# Altium schematic sheet PowerSrc.SchDoc
size A3
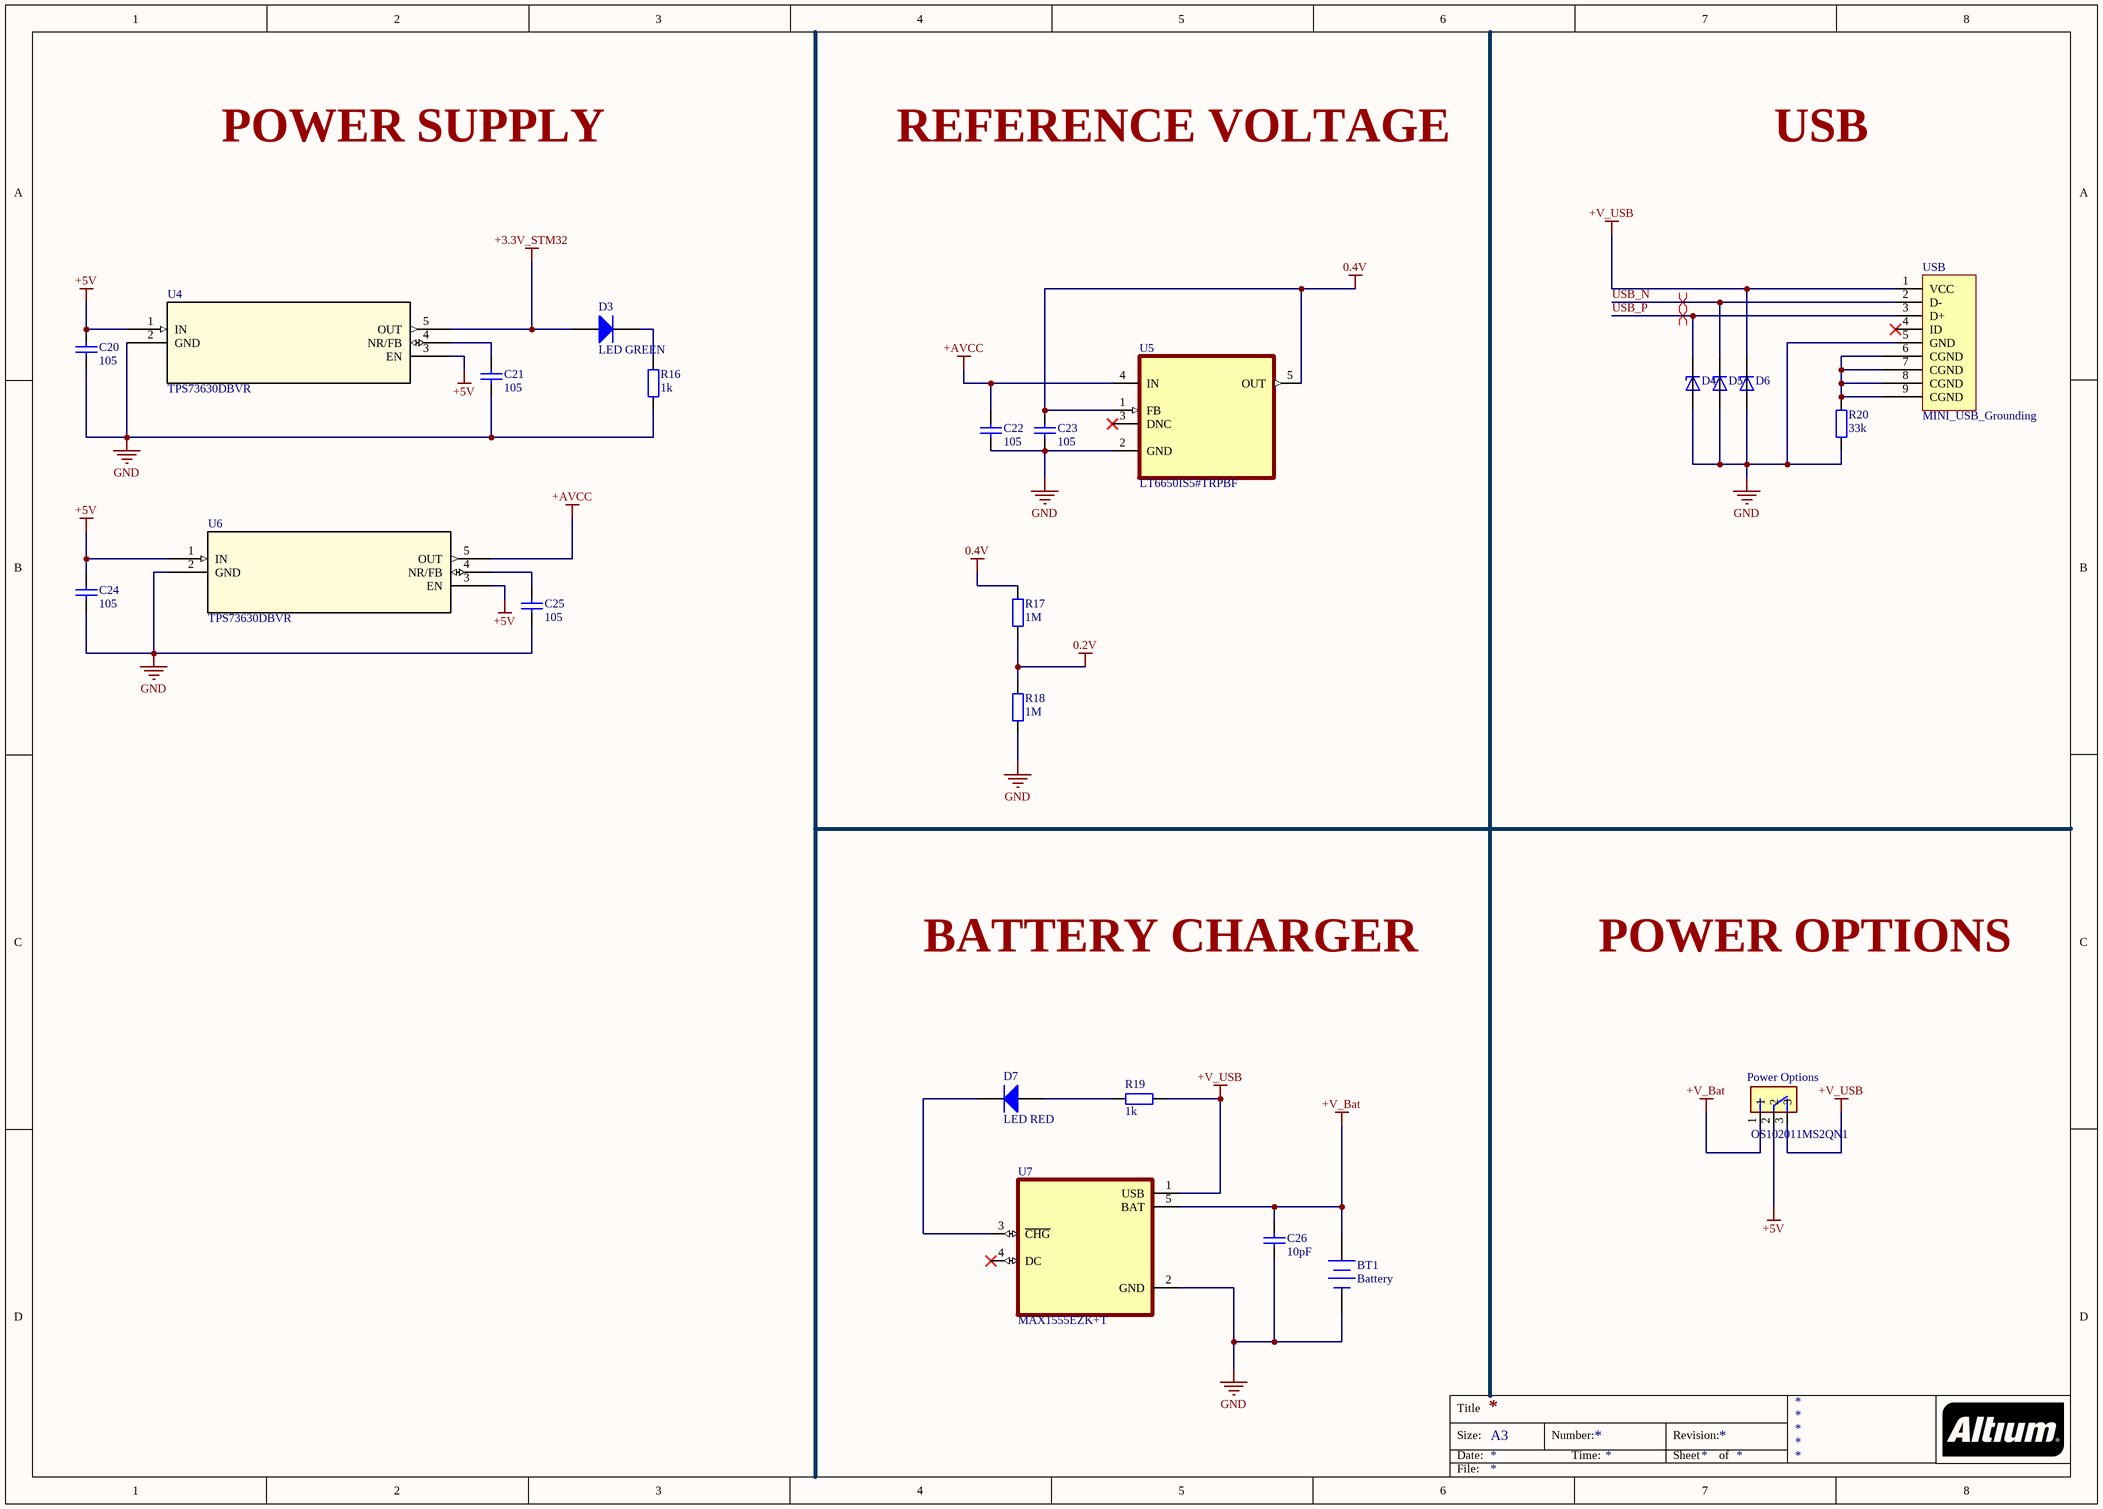
[diagram p0: PowerSrc.SchDoc]

## Parts
BT1  Battery  [BAT-2]
C20  105  [tu 0603]
C21  105  [tu 0603]
C22  105  [tu 0603]
C23  105  [tu 0603]
C24  105  [tu 0603]
C25  105  [tu 0603]
C26  10pF  [tu 0805]
D3  LED GREEN  [J1-0603]
D4  AVRL161A1R1NTA  [TVS_AVRL161A1R1NTA]  (value not drawn)
D5  AVRL161A1R1NTA  [TVS_AVRL161A1R1NTA]  (value not drawn)
D6  AVRL161A1R1NTA  [TVS_AVRL161A1R1NTA]  (value not drawn)
D7  LED RED  [J1-0603]
Power_Options  OS102011MS2QN1  [SW_OS102011MS2QN1]
R16  1k  [tro smd 0603]
R17  1M  [tro smd 0603]
R18  1M  [tro smd 0603]
R19  1k  [tro smd 0603]
R20  33k  [Tro smd 0603]
U4  TPS73630DBVR  [DBV5-M]
U5  LT6650IS5#TRPBF  [SOT95P280X100-5N]
U6  TPS73630DBVR  [DBV5-M]
U7  MAX1555EZK+T  [SOT95P275X110-5N]
USB  MINI_USB_Grounding  [micro_USB shilding]

## Nets
0.2V: R17.1 R18.2
0.4V: C23.1 R17.2 U5.1(FB) U5.5(OUT)
+3.3V_STM32: D3.1(A) U4.5(OUT)
+5V: C20.1 C24.1 Power_Options.2 U4.1(IN) U4.3(EN) U6.1(IN) U6.3(EN)
+AVCC: C22.1 U5.4(IN) U6.5(OUT)
+V_Bat: BT1.1(+) C26.1 Power_Options.1 U7.5(BAT)
+V_USB: D6.1(C) Power_Options.3 R19.2 U7.1(USB) USB.1(VCC)
GND: BT1.2(-) C20.2 C21.2 C22.2 C23.2 C24.2 C25.2 C26.2 D4.2(A) D5.2(A) D6.2(A) R16.2 R18.1 R20.1 U4.2(GND) U5.2(GND) U6.2(GND) U7.2(GND) USB.5(GND)
USB_N: D5.1(C) USB.2(D-)
USB_P: D4.1(C) USB.3(D+)
NetC21_1: C21.1 U4.4(NR/FB)
NetC25_1: C25.1 U6.4(NR/FB)
NetD3_2: D3.2(K) R16.1
NetD7_1: D7.1(A) R19.1
NetD7_2: D7.2(K) U7.3(~{CHG})
NetR20_2: R20.2 USB.6(CGND) USB.7(CGND) USB.8(CGND) USB.9(CGND)

Not connected (* = marked no-connect by the designer): U5 3(DNC)*; U7 4(DC)*; USB 4(ID)*

## Layout directives
differential pair; differential pair class diff90: USB_N, USB_P

## Notes on the sheet
- POWER SUPPLY
- REFERENCE VOLTAGE
- USB
- BATTERY CHARGER
- POWER OPTIONS
- Title
- Size:
- Date:
- A3
- Number:
- Time:
- Revision:
- Sheet
- of
- File:

## Library data of the parts
BT1 = Battery: Multicell Battery; Published: 24-Mar-1999; LatestRevisionDate: 17-Jul-2002; LatestRevisionNote: Re-released for DXP Platform.; PackageReference: BAT-2; Publisher: Altium Limited; PackageDescription: Battery; 2 Leads
C20-C25 = Tu 0603 105 16V 20%: Dán; Don_Vi: Con; So_Chan: 2; Ten_Linh_Kien: Tụ 0603 105-1uF 20% 16V; Ma_Hang: MH004574; Chung_Loai: Dán; Kieu_Chan: *
C26 = Tu 0805 10pF 50V 10%: Dán; Don_Vi: Con; So_Chan: 2; Ten_Linh_Kien: Tụ 0805 10P 10% 50V; Ma_Hang: MH004554; Chung_Loai: Dán; Kieu_Chan: *
D3 D7 = Diode: Default Diode; Published: 8-Jun-2000; LatestRevisionDate: 17-Jul-2002; LatestRevisionNote: Re-released for DXP Platform.; PackageDocument: Sep-1996; PackageReference: SMC; Publisher: Altium Limited; Code_JEDEC: DO-214-AB
D4-D6 = AVRL161A1R1NTA: MF: {'manufacturer': u'TDK'}; Package: None; Price: None; Value: *; MP: AVRL161A1R1NTA; Availability: Unavailable
Power_Options = OS102011MS2QN1: Switch Slide ON ON SPDT Top Slide 0.1A 12VDC 10000Cycles PC Pins Thru-Hole Bulk; MF: {'manufacturer': u'C&K'}; Package: None; Price: None; Value: *; MP: OS102011MS2QN1; Availability: Unavailable
R16 = Tro 0603 5% 1k: Dán; Don_Vi: Con; So_Chan: 2; Ten_Linh_Kien: Trở 0603 5% 1k; Ma_Hang: MH006319; Chung_Loai: Dán; Kieu_Chan: *
R17 R18 = Tro 0603 5% 1M: Dán; Don_Vi: Con; So_Chan: 2; Ten_Linh_Kien: Trở 0603 5% 1M; Ma_Hang: MH006909; Chung_Loai: Dán; Kieu_Chan: *
R19 = Tro 0603 1% 1k: Dán; So_Chan: 2; Don_Vi: Con; Ten_Linh_Kien: Trở 0603 1% 1k; Ma_Hang: MH006334; Chung_Loai: Dán; Kieu_Chan: *
R20 = Tro 0603 1% 33k: Dán; Don_Vi: Con; So_Chan: 2; Ten_Linh_Kien: Trở 0603 1% 33k; Ma_Hang: MH006335; Chung_Loai: Dán; Kieu_Chan: *
U4 U6 = TPS73630DBVR: No Description Available; Mfr_Name: Texas Instruments; RefDes: RefDes; Type: Type
U5 = LT6650IS5#TRPBF: Micropower, 400mV Reference with Rail-to-Rail Buffer Amplifier; MF: {'manufacturer': u'Analog Devices'}; Package: None; Price: None; Value: *; MP: LT6650IS5#TRPBF; Availability: Unavailable
U7 = MAX1555EZK+T: MF: {'manufacturer': u'Analog Devices'}; Package: None; Price: None; Value: *; MP: MAX1555EZK+T; Availability: Unavailable